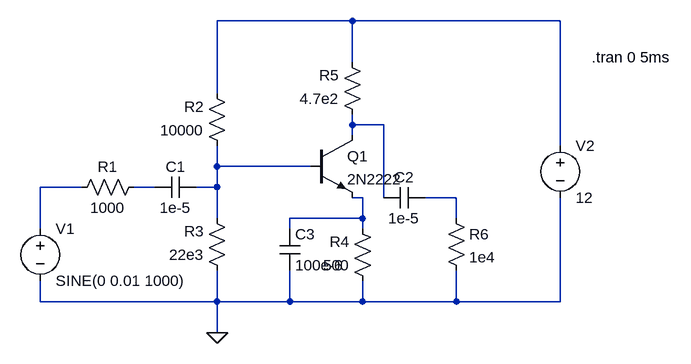
[diagram p0: schematic classA.asc]
classA.asc, the LTspice schematic file:
Version 4
SHEET 1 1296 680
WIRE 784 0 576 0
WIRE 1104 0 784 0
WIRE 784 64 784 0
WIRE 576 112 576 0
WIRE 784 160 784 144
WIRE 832 160 784 160
WIRE 784 176 784 160
WIRE 1104 192 1104 0
WIRE 576 224 576 192
WIRE 720 224 576 224
WIRE 368 256 304 256
WIRE 480 256 448 256
WIRE 576 256 576 224
WIRE 576 256 544 256
WIRE 800 272 784 272
WIRE 832 272 832 160
WIRE 944 272 896 272
WIRE 576 304 576 256
WIRE 800 304 800 272
WIRE 800 304 688 304
WIRE 944 304 944 272
WIRE 304 320 304 256
WIRE 688 320 688 304
WIRE 800 320 800 304
WIRE 304 432 304 400
WIRE 576 432 576 384
WIRE 576 432 304 432
WIRE 688 432 688 384
WIRE 688 432 576 432
WIRE 800 432 800 400
WIRE 800 432 688 432
WIRE 944 432 944 384
WIRE 944 432 800 432
WIRE 1104 432 1104 272
WIRE 1104 432 944 432
WIRE 576 480 576 432
FLAG 576 480 0
SYMBOL voltage 304 304 R0
SYMATTR InstName V1
SYMATTR Value SINE(0 0.01 1000)
SYMBOL voltage 1104 176 R0
SYMATTR InstName V2
SYMATTR Value 12
SYMBOL Res 464 240 R90
WINDOW 0 0 56 VBottom 2
WINDOW 3 32 56 VTop 2
SYMATTR InstName R1
SYMATTR Value 1000
SYMBOL Res 592 208 R180
WINDOW 0 36 76 Left 2
WINDOW 3 36 40 Left 2
SYMATTR InstName R2
SYMATTR Value 10000
SYMBOL Res 592 400 R180
WINDOW 0 36 76 Left 2
WINDOW 3 36 40 Left 2
SYMATTR InstName R3
SYMATTR Value 22e3
SYMBOL Res 816 416 R180
WINDOW 0 36 76 Left 2
WINDOW 3 36 40 Left 2
SYMATTR InstName R4
SYMATTR Value 500
SYMBOL Res 800 160 R180
WINDOW 0 36 76 Left 2
WINDOW 3 36 40 Left 2
SYMATTR InstName R5
SYMATTR Value 4.7e2
SYMBOL npn 720 176 R0
SYMATTR InstName Q1
SYMATTR Value 2N2222
SYMBOL Cap 544 240 R90
WINDOW 0 0 32 VBottom 2
WINDOW 3 32 32 VTop 2
SYMATTR InstName C1
SYMATTR Value 1e-5
SYMBOL Cap 896 256 R90
WINDOW 0 0 32 VBottom 2
WINDOW 3 32 32 VTop 2
SYMATTR InstName C2
SYMATTR Value 1e-5
SYMBOL Res 928 288 R0
SYMATTR InstName R6
SYMATTR Value 1e4
SYMBOL Cap 672 320 R0
SYMATTR InstName C3
SYMATTR Value 100e-6
TEXT 1152 56 Left 2 !.tran 0 5ms

The netlist it stands for:
* classA.asc
V1 N004 0 SINE(0 0.01 1000)
V2 N001 0 12
R1 N005 N004 1000
R2 N003 N001 10000
R3 0 N003 22e3
R4 0 N006 500
R5 N002 N001 4.7e2
Q1 N002 N003 N006 0 2N2222
C1 N003 N005 1e-5
C2 N007 N002 1e-5
R6 N007 0 1e4
C3 N006 0 100e-6
.model NPN NPN
.model PNP PNP
.lib standard.bjt
.tran 0 5ms
.backanno
.end